# EAGLE schematic surficial_tilt_shield (EAGLE 9.2.0)

## Sheet 1 of 2
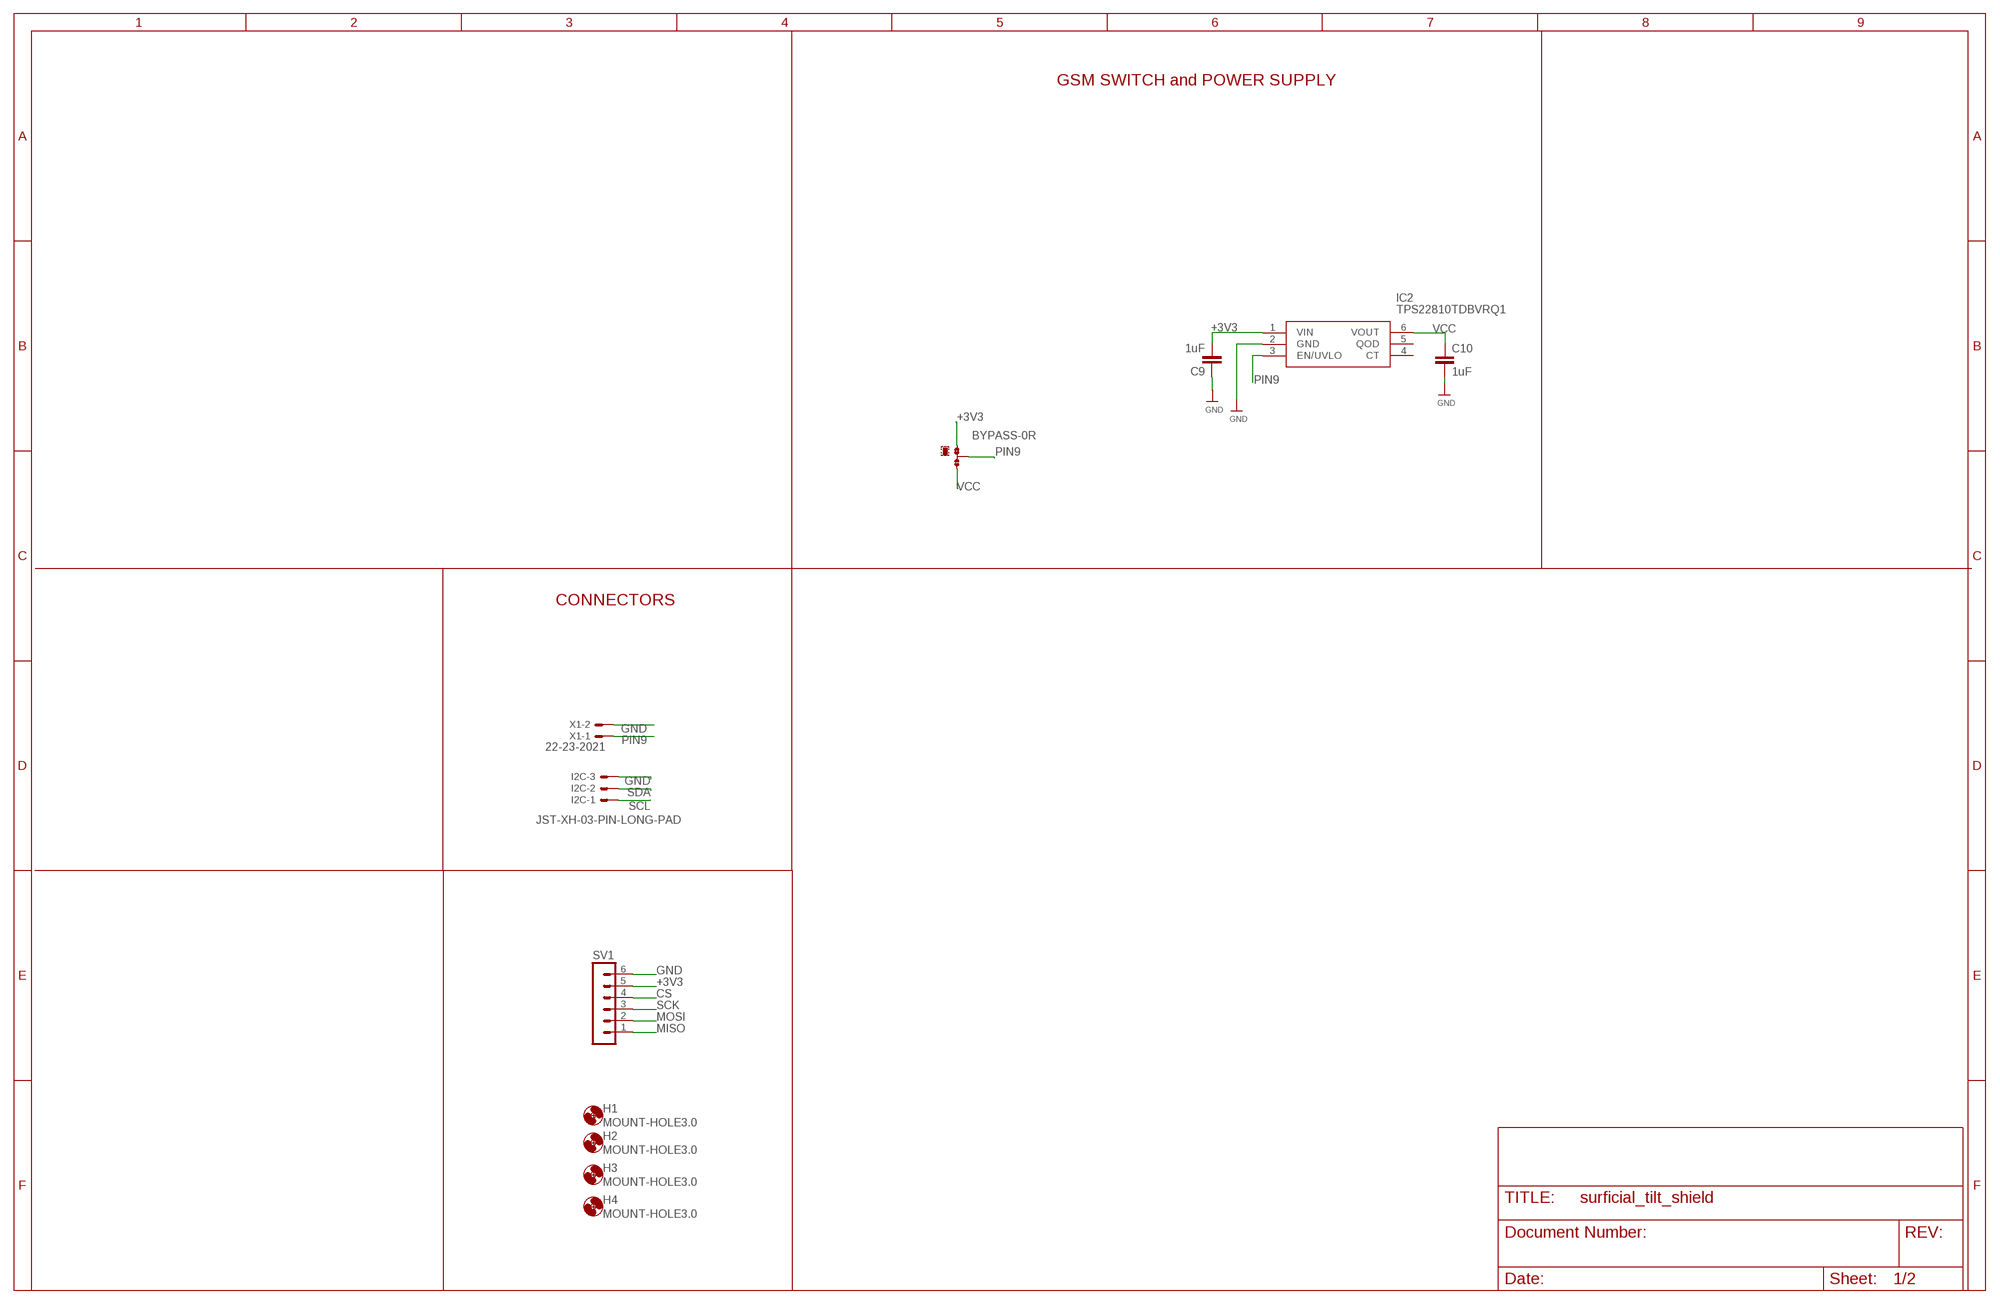
[diagram p0: schematic, sheet 1]

### Parts
BYPASS  0R-JUMPB  [B0R-JMP]
C9  1uF  CC0603  [C0603]
C10  1uF  CC0603  [C0603]
H1  MOUNT-HOLE3.0  [3,0]
H2  MOUNT-HOLE3.0  [3,0]
H3  MOUNT-HOLE3.0  [3,0]
H4  MOUNT-HOLE3.0  [3,0]
I2C  JST-XH-03-PIN-LONG-PAD  [JST-XH-03-PACKAGE-LONG-PAD]
IC2  TPS22810TDBVRQ1  [SOT95P280X145-6N]
SV1  MA06-1  [MA06-1]
X1  22-23-2021  [22-23-2021]

### Nets
+3V3: BYPASS.1 C9.2 IC2.1(VIN) SV1.5
CS: SV1.4
GND: C9.1 C10.2 I2C.3 IC2.2(GND) SV1.6 X1.2 ; also sheet 2
MISO: SV1.1
MOSI: SV1.2
PIN9: BYPASS.2 IC2.3(EN/UVLO) X1.1
SCK: SV1.3
SCL: I2C.1 ; also sheet 2
SDA: I2C.2 ; also sheet 2
VCC: BYPASS.3 C10.1 IC2.6(VOUT) ; also sheet 2
Unconnected: IC2.4(CT) IC2.5(QOD)

### Notes on the sheet
- GSM SWITCH and POWER SUPPLY
- CONNECTORS

## Sheet 2 of 2
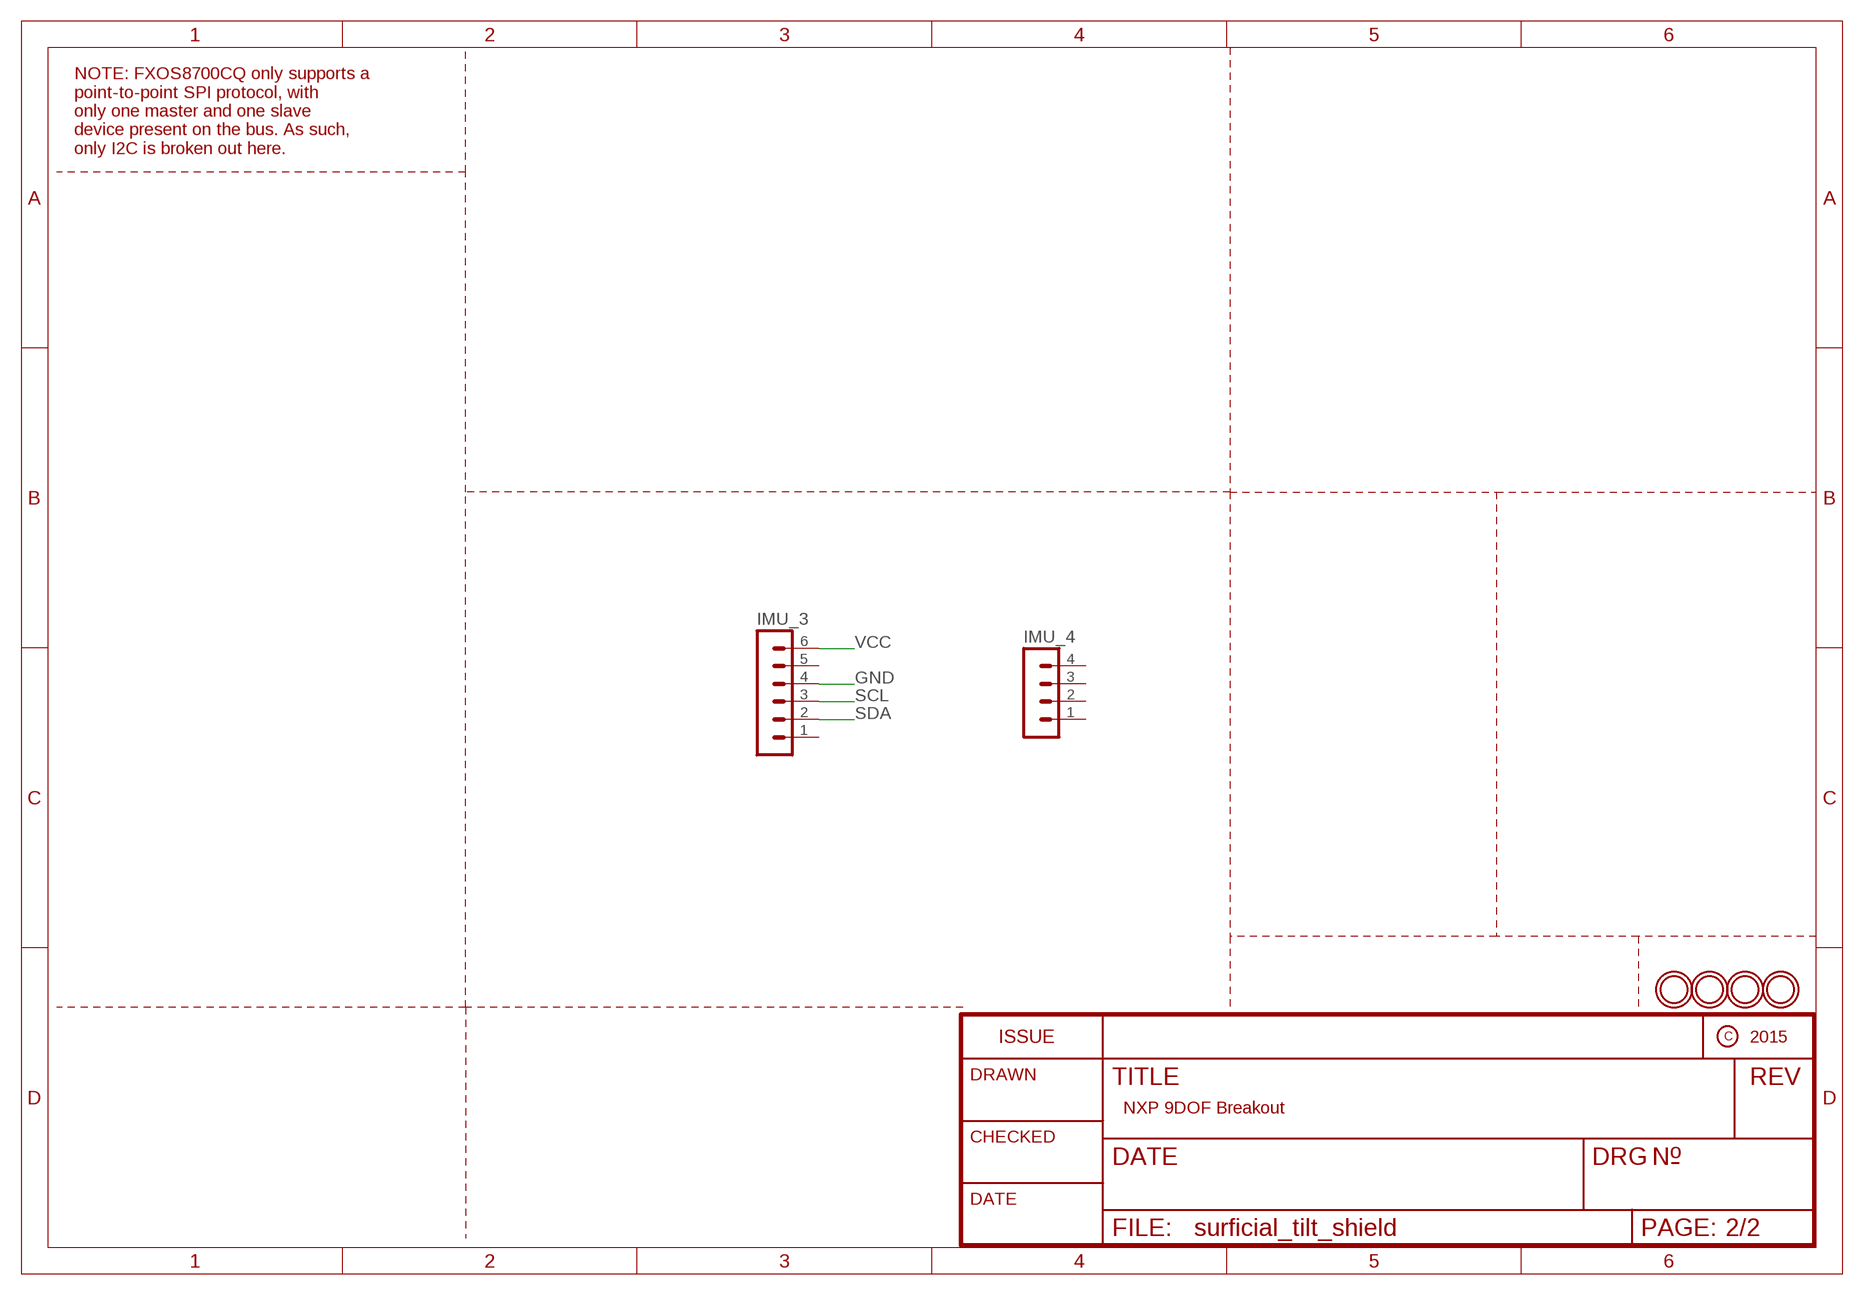
[diagram p1: schematic, sheet 2]

### Parts
IMU_3  MA06-1  [MA06-1]
IMU_4  MA04-1  [MA04-1]
U$1  MOUNTINGHOLE2.5  [MOUNTINGHOLE_2.5_PLATED]
U$2  MOUNTINGHOLE2.5  [MOUNTINGHOLE_2.5_PLATED]
U$3  MOUNTINGHOLE2.5  [MOUNTINGHOLE_2.5_PLATED]
U$4  MOUNTINGHOLE2.5  [MOUNTINGHOLE_2.5_PLATED]

### Nets
GND: IMU_3.4 ; also sheet 1
SCL: IMU_3.3 ; also sheet 1
SDA: IMU_3.2 ; also sheet 1
VCC: IMU_3.6 ; also sheet 1
Unconnected: IMU_3.1 IMU_3.5 IMU_4.1 IMU_4.2 IMU_4.3 IMU_4.4

### Notes on the sheet
- NOTE: FXOS8700CQ only supports a
  point-to-point SPI protocol, with
  only one master and one slave
  device present on the bus. As such,
  only I2C is broken out here.
- NXP 9DOF Breakout

## Library data of the parts
BYPASS = jump-0r-smd:0R-JUMP: SMD 0R 0805 Jumper
C9 C10 = eagle-ltspice:C: CAPACITOR, European symbol; SPICEMODEL: NONE; SPICEPREFIX: C
H1-H4 = holes:MOUNT-HOLE: MOUNTING HOLE with drill center marker
I2C = Rembrandt Electronics - JST XH Connectors v1-0:JST-XH-03-PIN: JST XH Connector 2 Pin Wire to board connector. Pitch: 2,54 mm, (0.100") Number of pins: 3 Created by Rembrandt Electronics www.rembrandtelectronics.com
IC2 = TPS22810TDBVRQ1:TPS22810TDBVRQ1: Automotive 18V, 2A, 79m Load Switch With Adjustable Rise Time and Adjustable Quick Output Discharge Source: Datasheet <http://www.ti.com/lit/gpn/tps22810-q1>; DESCRIPTION: Automotive 18V, 2A, 79m Load Switch With Adjustable Rise Time and Adjustable Quick Output Discharge; HEIGHT: 1.45mm; MANUFACTURER_NAME: Texas Instruments; MANUFACTURER_PART_NUMBER: TPS22810TDBVRQ1
IMU_3 SV1 = con-lstb:MA06-1: PIN HEADER; OC_FARNELL: unknown; OC_NEWARK: unknown
IMU_4 = con-lstb:MA04-1: PIN HEADER; OC_FARNELL: unknown; OC_NEWARK: unknown
U$1-U$4 = microbuilder:MOUNTINGHOLE: Mounting Hole For #2 screws (0.086"/2.18mm width, 0.094"/2.4mm hole) use 2.5mm; BOM: EXCLUDE
X1 = con-molex:22-23-2021: .100" (2.54mm) Center Header - 2 Pin; MF: MOLEX; MPN: 22-23-2021; OC_FARNELL: 1462926; OC_NEWARK: 25C3832